# EasyEDA Pro project CH585M-R1(3)(1)(5).eprj, board PCB7
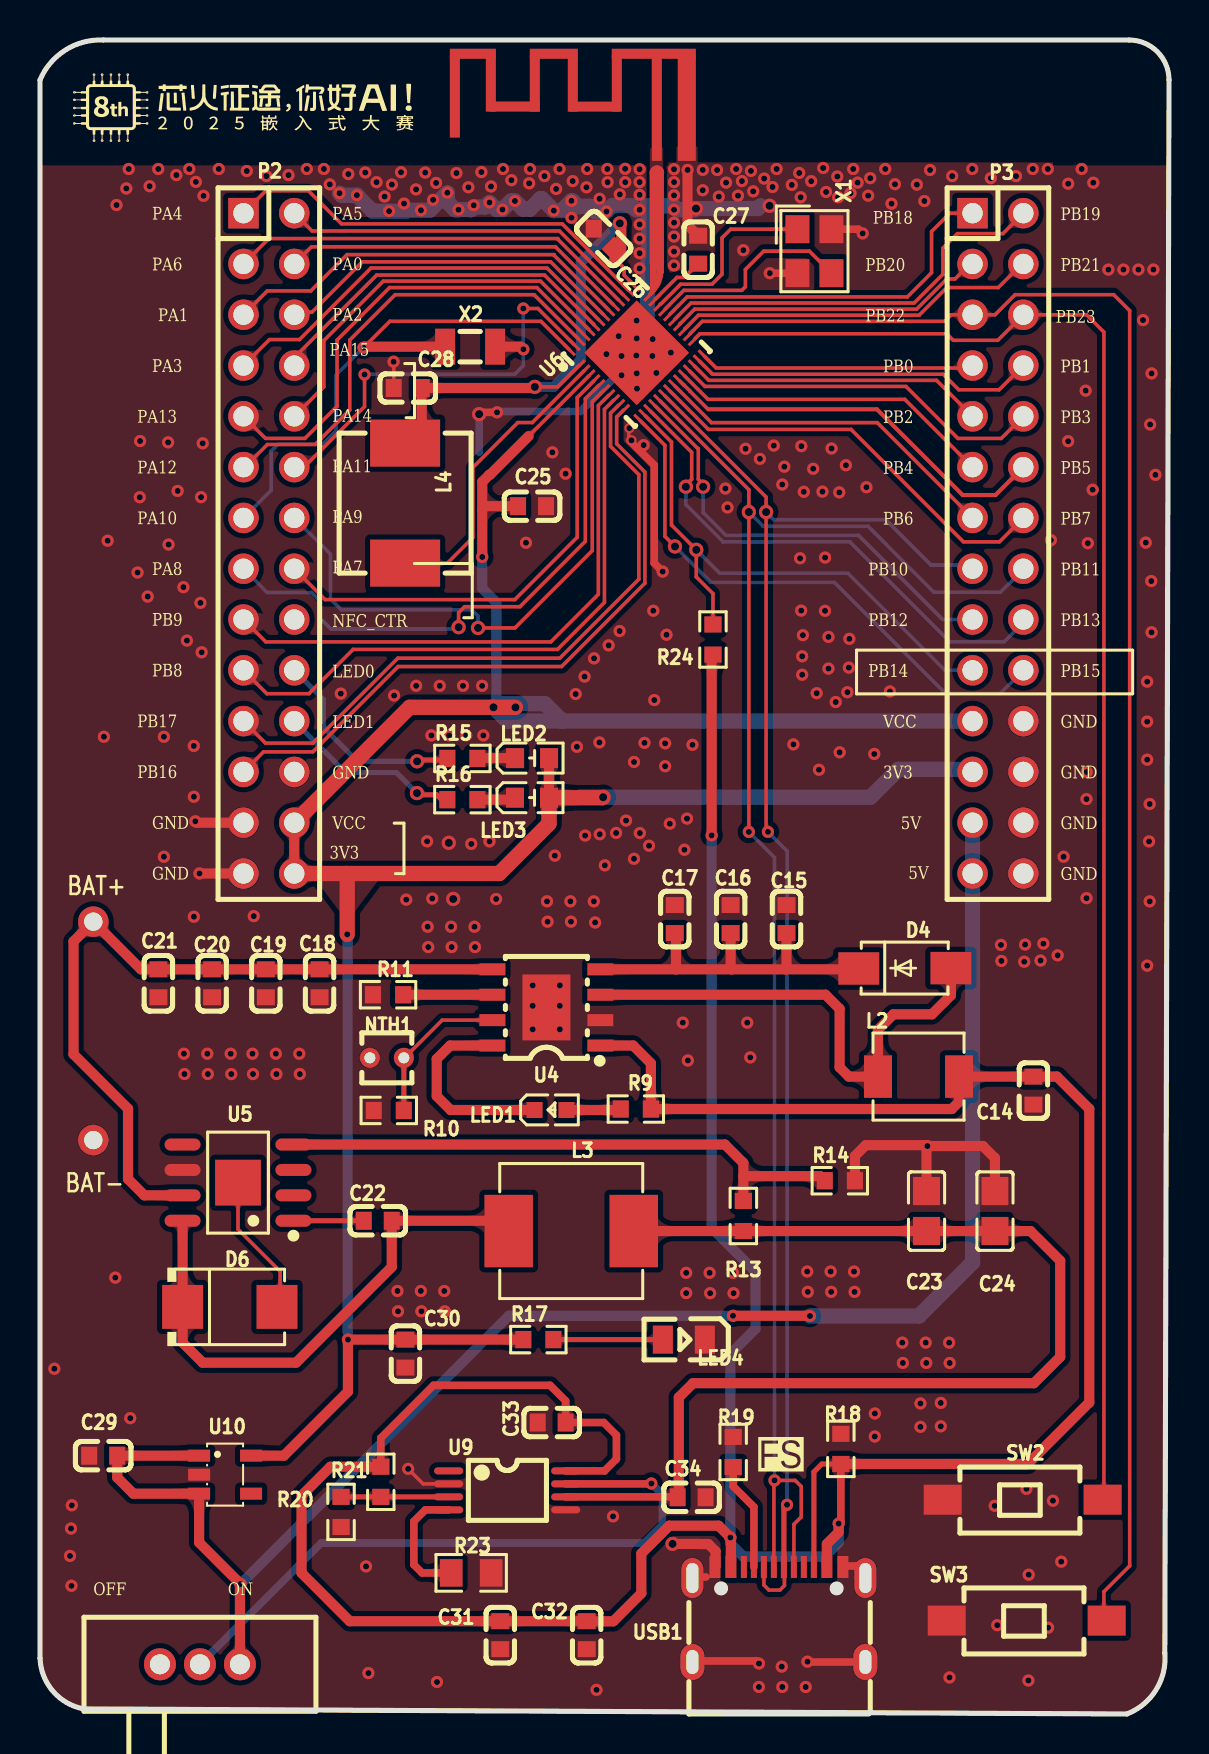
[diagram p10: board, top side]
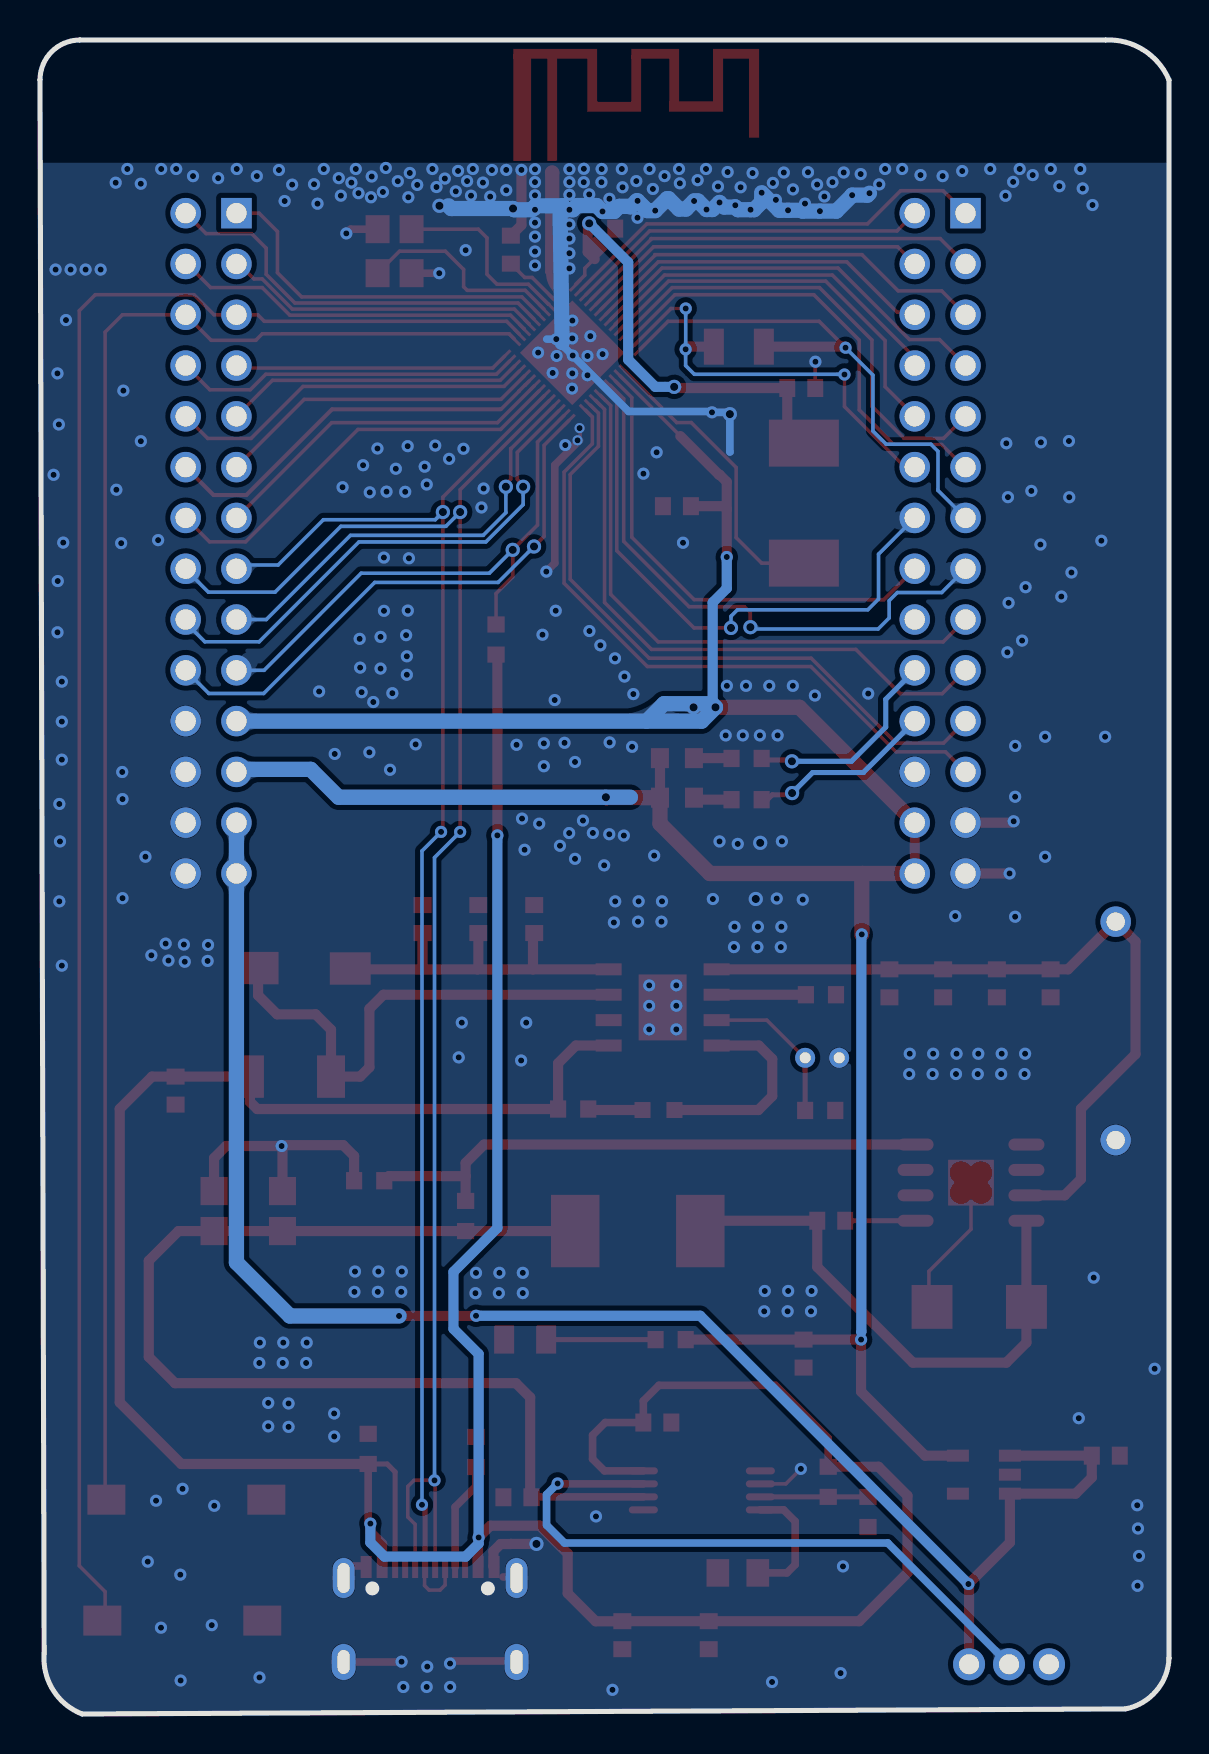
[diagram p11: board, bottom side, seen from below]

Outline 56.47 x 83.71 mm; copper layers: Top Layer, Bottom Layer. Coordinates in mm from the lower left corner of the outline.
Outline path: 0,81.71 arc(1.27,83.21) 3.16,83.71 54.47,83.71 arc(55.88,83.13) 56.47,81.71 56.26,3.05 arc(55.82,1.21) 54.36,0 2.18,0.25 arc(0.65,1.14) 0,2.79 0,81.71
Stack: Top Layer 0.035mm / Dielectric1 1.51mm FR4 er 4.5 / Bottom Layer 0.035mm

## Design rules (mm)
net PB11: DP1
net PB10: DP1
template: 自定义配置
spacing Clearance (default): track to track 0.127, other pairs 0 to 0.152
spacing Clearance_1: track to track 0.152, other pairs 0.152 to 0.152
spacing Clearance_3: track to track 0.254, other pairs 0 to 0.254
track width Width (default): min 0.127, default 0.178, max 1.27
differential pair DiffPairsRouting (default): width min 0.178, default 0.381, max 0.381; gap min 0.152, default 0.254
via RoutingVias (default): diameter min 0.508, default 0.61, max 1.27; hole min 0.305, default 0.305, max 0.711
region e2530 uses Clearance_1, DiffPairsRouting, HoleToHoleClearance, PlaneConnect, RF, RoutingVias, Width

## Placement (name value [footprint] x y rotation side)
C14  100nF  [C0603]  49.69 31.17 90 top
C15  10uF  [C0603]  37.34 39.75 270 top
C16  10uF  [C0603]  34.54 39.75 270 top
C17  10uF  [C0603]  31.75 39.75 270 top
C18  10uF  [C0603]  13.98 36.54 90 top
C19  10uF  [C0603]  11.3 36.54 90 top
C20  10uF  [C0603]  8.61 36.54 90 top
C21  10uF  [C0603]  5.92 36.54 90 top
C22  100nF  [C0603]  16.89 24.67 0 top
C23  22uF  [C0805]  44.34 25.15 90 top
C24  22uF  [C0805]  47.76 25.15 90 top
C25  2.2uF  [C0603]  24.61 60.4 180 top
C26  100nF  [C0603#2]  28.19 73.78 135 top
C27  470nF  [C0603]  32.92 73.23 270 top
C28  4.7uF  [C0603]  18.39 66.31 0 top
C29  10uF  [C0603]  3.16 12.92 0 top
C30  22uF  [C0603]  18.28 18.02 90 top
C31  22uF  [C0603]  23.02 3.94 90 top
C32  22uF  [C0603]  27.34 3.94 90 top
C33  100nF  [C0603]  25.59 14.58 180 top
C34  100nF  [C0603]  32.59 10.84 180 top
D4  SS54  [SMA_L4.3-W2.6-LS5.0-FD]  43.26 37.29 180 top
D6  SS54SMB  [SMB_L4.6-W3.6-LS5.3-RD]  9.49 20.36 0 top
E1  F  [ANT-F-1-2.4G-1.6mmFR4]  30.86 77.98 0 top
L2  2.2uH  [IND-SMD_L4.4-W4.2]  43.94 31.88 0 top
L3  15uH  [IND-SMD_L7.0-W6.6_FXL0630]  26.57 24.15 180 top
L4  10uH  [IND-SMD_L7.3-W6.8]  18.26 60.55 90 top
LED1  LTST-C190KSKT  [LED0603-RD]  25.53 30.2 0 top
LED2  YLED0603B  [LED0603-FD]  24.61 45.82 180 top
LED3  YLED0603R  [LED0603-FD]  24.61 47.8 180 top
LED4  NCD0805R1  [LED0805-R-RD]  32.2 18.72 180 top
NOREF  -  [Pad_e1653]  2.67 28.7 0 top
NOREF#2  -  [Pad_e1652]  2.67 39.62 0 top
NTH1  100K  [RES-TH_L2.5-W2.5-P1.70-D0.3]  17.35 32.81 180 top
P2  HEADER 14x2  [IDC28-2.54MM]  10.18 75.05 0 top
P3  HEADER 14x2  [IDC28-2.54MM]  46.64 75.05 0 top
R9  1kΩ  [R0603]  29.8 30.25 180 top
R10  82kΩ  [R0603]  17.45 30.18 180 top
R11  1kΩ  [R0603]  17.41 35.97 180 top
R13  10kΩ  [R0603]  35.18 24.9 90 top
R14  3.16kΩ  [R0603]  40.01 26.67 0 top
R15  1kΩ  [R0603]  21.13 47.78 0 top
R16  1kΩ  [R0603]  21.13 45.72 0 top
R17  1kΩ  [R0603]  24.93 18.72 0 top
R18  5.1kΩ  [R0603]  40.06 13.26 270 top
R19  5.1kΩ  [R0603]  34.67 13.1 270 top
R20  10kΩ  [R0603]  15.06 10.11 90 top
R21  47kΩ  [R0603]  17.05 11.61 90 top
R23  400Ω  [R0805]  21.57 7.06 180 top
R24  10kΩ  [R0603]  33.66 53.73 270 top
SW1  SSSS916900  [SW-TH_SSSS916900]  8 2.49 90 top
SW2  TS-1101-C-W  [SW-SMD_L6.0-W3.3-LS8.0]  49.15 10.72 0 top
SW3  TS-1101-C-W  [SW-SMD_L6.0-W3.3-LS8.0]  49.35 4.67 0 top
U4  SCS5090EA  [ESOP-8_L4.9-W3.9-P1.27-LS6.0-BL-EP3.3]  25.33 35.33 90 top
U5  TPS5450DDAR  [SOP-8_L4.9-W3.9-P1.27-LS6.0-BL-EP]  9.9 26.57 90 top
U6  CH585M  [QFN-48_L5.0-W5.0-P0.35-TL-EP3.7-1]  29.85 68.07 45 top
U9  TPS2113APWR  [TSSOP-8_L4.4-W3.0-P0.65-LS6.4-BL]  23.37 11.18 270 top
U10  XC6219B332MR-G  [SOT-23-5_L3.0-W1.7-P0.95-LS2.8-BR]  9.26 11.97 180 top
USB1  TYPE-C 16PIN 2MD(073)  [USB-C-SMD_TYPE-C-6PIN-2MD-073]  36.96 4.98 0 top
X1  32MHz  [CRYSTAL-SMD_4P-L3.2-W2.5-BL]  38.73 73.15 270 top
X2  32.768kHz  [FC-135R_L3.2-W1.5]  21.51 68.37 0 top

## Footprints (pads in the part's own frame, mm; a bottom-side part is the same pattern mirrored in y, then rotated)
ANT-F-1-2.4G-1.6mmFR4
  rect 0.8x0.6 smd: 0(1.483,0)
  rect 0.4x0.6 smd: 1(0,0)
C0603
  rect 0.8x0.9 smd: 1(-0.7,0) 2(0.7,0)
C0603#2
  rect 0.8x0.9 smd: 1(-0.7,0)
  rect 0.8x0.9 smd rot 45: 2(0.7,0)
C0805
  rect 1.41x1.35 smd: 1(-1,0) 2(1,0)
CRYSTAL-SMD_4P-L3.2-W2.5-BL
  rect 1.4x1.2 smd: 1(-1.1,-0.85) 2(1.1,-0.85) 3(1.1,0.85) 4(-1.1,0.85)
ESOP-8_L4.9-W3.9-P1.27-LS6.0-BL-EP3.3
  rect 0.6x1.3 smd: 1(-1.905,-2.7) 2(-0.635,-2.7) 3(0.635,-2.7) 4(1.905,-2.7) 5(1.905,2.7) 6(0.635,2.7) 7(-0.635,2.7) 8(-1.905,2.7)
  rect 3.3x2.4 smd: 9(0,0)
FC-135R_L3.2-W1.5
  rect 1x1.8 smd: 1(-1.25,0) 2(1.25,0)
IDC28-2.54MM
  rect 1.524x1.524 hole 1.016: 1(0,0)
  round 1.524 hole 1.016: 2(2.54,0) 3(0,-2.54) 4(2.54,-2.54) 5(0,-5.08) 6(2.54,-5.08) 7(0,-7.62) 8(2.54,-7.62) 9(0,-10.16) 10(2.54,-10.16) 11(0,-12.7) 12(2.54,-12.7) 13(0,-15.24) 14(2.54,-15.24) 15(0,-17.78) 16(2.54,-17.78) 17(0,-20.32) 18(2.54,-20.32) 19(0,-22.86) 20(2.54,-22.86) 21(0,-25.4) 22(2.54,-25.4) 23(0,-27.94) 24(2.54,-27.94) 25(0,-30.48) 26(2.54,-30.48) 27(0,-33.02) 28(2.54,-33.02)
IND-SMD_L4.4-W4.2
  rect 1.4x2.12 smd: 1(2.028,0) 2(-2.028,0)
IND-SMD_L7.0-W6.6_FXL0630
  rect 2.424x3.62 smd: 1(3.128,0) 2(-3.128,0)
IND-SMD_L7.3-W6.8
  rect 2.35x3.5 smd: 1(-3,0) 2(3,0)
LED0603-FD
  rect 0.9x1 smd: 1(-0.85,0) 2(0.85,0)
LED0603-RD
  rect 0.8x0.8 smd: 1(-0.799,0) 2(0.799,0)
LED0805-R-RD
  rect 1x1.399 smd: 1(1.05,0) 2(-1.05,0)
Pad_e1652
  round 1.524 hole 0.914: 1(0,0)
Pad_e1653
  round 1.524 hole 0.914: 1(0,0)
QFN-48_L5.0-W5.0-P0.35-TL-EP3.7-1
  rect 0.8x0.15 smd: 1(-2.5,1.575) 2(-2.5,1.225) 3(-2.5,0.875) 4(-2.5,0.525) 5(-2.5,0.175) 6(-2.5,-0.175) 7(-2.5,-0.525) 8(-2.5,-0.875) 9(-2.5,-1.225) 10(-2.5,-1.575) 25(2.5,-1.575) 26(2.5,-1.225) 27(2.5,-0.875) 28(2.5,-0.525) 29(2.5,-0.175) 30(2.5,0.175) 31(2.5,0.525) 32(2.5,0.875) 33(2.5,1.225) 34(2.5,1.575)
  rect 0.15x0.8 smd: 11(-2.275,-2.5) 12(-1.925,-2.5) 13(-1.575,-2.5) 14(-1.225,-2.5) 15(-0.875,-2.5) 16(-0.525,-2.5) 17(-0.175,-2.5) 18(0.175,-2.5) 19(0.525,-2.5) 20(0.875,-2.5) 21(1.225,-2.5) 22(1.575,-2.5) 23(1.925,-2.5) 24(2.275,-2.5) 35(2.275,2.5) 36(1.925,2.5) 37(1.575,2.5) 38(1.225,2.5) 39(0.875,2.5) 40(0.525,2.5) 41(0.175,2.5) 42(-0.175,2.5) 43(-0.525,2.5) 44(-0.875,2.5) 45(-1.225,2.5) 46(-1.575,2.5) 47(-1.925,2.5) 48(-2.275,2.5)
  rect 3.7x3.7 smd: 49(0.001,0)
R0603
  rect 0.806x0.864 smd: 1(-0.753,0) 2(0.753,0)
R0805
  rect 1.133x1.377 smd: 1(-1,0) 2(1,0)
RES-TH_L2.5-W2.5-P1.70-D0.3
  round 1 hole 0.55: 1(-0.85,0) 2(0.85,0)
SMA_L4.3-W2.6-LS5.0-FD
  rect 2.046x1.62 smd: 1(-2.304,-0.009) 2(2.304,0.009)
SMB_L4.6-W3.6-LS5.3-RD
  rect 2.047x2.192 smd: 1(-2.361,0) 2(2.361,0)
SOP-8_L4.9-W3.9-P1.27-LS6.0-BL-EP
  oval 0.6x1.8 smd: 1(-1.905,-2.772) 2(-0.635,-2.772) 3(0.635,-2.772) 4(1.905,-2.772) 5(1.905,2.772) 6(0.635,2.772) 7(-0.635,2.772) 8(-1.905,2.772)
  rect 2.29x2.29 smd: 9(0,0)
SOT-23-5_L3.0-W1.7-P0.95-LS2.8-BR
  rect 1.1x0.6 smd: 1(1.3,-0.95) 2(1.3,0) 3(1.3,0.95) 4(-1.3,0.95) 5(-1.3,-0.95)
SW-SMD_L6.0-W3.3-LS8.0
  rect 1.9x1.5 smd: 1(-4,0) 2(4,0)
SW-TH_SSSS916900
  round 1.6 hole 1: 1(0,2) 2(0,0) 3(0,-2)
TSSOP-8_L4.4-W3.0-P0.65-LS6.4-BL
  oval 0.353x1.454 smd: 1(-0.975,-2.927) 2(-0.325,-2.927) 3(0.325,-2.927) 4(0.975,-2.927) 5(0.975,2.927) 6(0.325,2.927) 7(-0.325,2.927) 8(-0.975,2.927)
USB-C-SMD_TYPE-C-6PIN-2MD-073
  rect 0.55x1.1 smd: 1(-3.2,2.375) 2(-2.4,2.375) 11(2.4,2.375) 12(3.2,2.375)
  rect 0.3x1.1 smd: 3(-1.75,2.375) 4(-1.25,2.375) 5(-0.75,2.375) 6(-0.25,2.375) 7(0.25,2.375) 8(0.75,2.375) 9(1.25,2.375) 10(1.75,2.375)
  oval 1.1x2 hole 0.6x1.5: 13(-4.325,1.825) 14(4.325,1.825)
  oval 1.2x1.8 hole 0.6x1.2: 13(-4.325,-2.375) 14(4.325,-2.375)

## Nets
As in the schematic, except:
GND: C14.1 C15.1 C16.1 C17.1 C18.1 C19.1 C20.1 C21.1 C23.2 C24.2 C25.1 C26.2 C27.1 C28.1 C29.1 C30.1 C31.1 C32.1 C33.2 C34.1 LED4.2 NOREF.1 NTH1.2 P2.24 P2.25 P2.27 P3.22 P3.24 P3.26 P3.28 R10.2 R11.2 R14.2 R18.1 R19.1 R20.1 R23.1 SW2.1 SW3.1 U4.2 U4.9 U5.6 U6.49 U9.2 U9.5 U10.2 USB1.1 USB1.12 USB1.13 USB1.14 X1.2 X1.4
BAT+: C18.2 C19.2 C20.2 C21.2 NOREF#2.1 U4.5 U5.7

Pads without a net: E1 0; P2 18; SW1 1; U5 2 3 5; U9 1; U10 4; USB1 3 9

## Via types
v1: diameter 0.61, hole 0.305, Top Layer to Bottom Layer, 387 vias
v2: diameter 0.711, hole 0.406, Top Layer to Bottom Layer, 21 vias
v3: diameter 0.508, hole 0.305, Top Layer to Bottom Layer, 2 vias

## Routing (per net, layer and track width the routed paths; a pad name or vN(x,y) marks a point on that pad's centre or on a via; arc(x,y) is an arc through that point)
+3V3: length 145.5
  Top Layer w0.178: 27.46,66.92 24.44,63.9
  Top Layer w0.508: 22.12,60.24 22.28,60.4 C25.2 ; 22.12,60.24 v1(22.12,57.86) ; 22.12,60.24 22.12,61.61 22.48,61.97 22.51,61.97 24.44,63.9 ; LED3.1 25.46,47.8 LED2.1 ; U10.5 12.2,12.92 15.4,16.12 v1(15.4,18.72) C30.2 R17.1 ; P2.26 P2.28
  Top Layer w0.762: 15.33,42.03 15.37,41.99 v1(15.37,38.99) ; 15.33,42.03 P2.28 ; 15.33,42.03 22.97,42.03 25.46,44.52 LED2.1 28.14,45.82 v2(28.17,45.84) ; P2.26 18.49,50.34 v2(22.68,50.34) 22.69,50.34 v2(23.78,50.34)
  Bottom Layer w0.508: 22.86,50.52 22.83,50.56 22.83,55.58 22.12,56.29 v1(22.12,57.86) ; 15.4,19.11 15.39,19.12 15.39,38.94 15.37,38.96 v1(15.37,38.99)
  Bottom Layer w0.762: 26.94,45.84 v2(28.17,45.84) 41.54,45.84 42.93,47.24 46.52,47.24 P3.23 ; 26.13,49.65 23.37,49.65 v2(22.68,50.34) 22.86,50.52 25.26,50.52 26.13,49.65 ; 26.13,49.65 P3.21
+5V: length 177.8
  Top Layer w0.254: 38.71,7.35 38.71,12.1 39.11,12.5 R18.2
  Top Layer w0.381: R18.2 40.06,9.63 v1(39.95,9.52) ; R21.2 17.05,13.8 19.68,16.44 25.51,16.44 26.29,15.66 C33.1 28.2,14.58 28.83,13.94 28.83,12.75 28.24,12.16 U9.8
  Top Layer w0.508: v1(39.95,9.52) 39.95,9.09 39.36,8.51 USB1.11 ; USB1.2 34.56,8.8 v1(34.53,8.83) 33.94,9.42 31.47,9.42 30.08,8.02 30.08,6.04 28.68,4.64 27.35,4.64 C32.2 C31.2 15.49,4.64 13.08,7.05 13.08,10.92 14.53,12.37 R21.2 ; R24.2 33.59,52.91 v1(33.59,43.94) ; 28.03,33.43 29.67,33.43 30.55,32.54 30.55,30.25 45.6,30.25 45.97,30.62 L2.1 C14.2 50.87,31.88 52.48,30.26 52.48,15.58 49.4,12.5 R18.2
  Bottom Layer w0.508: v1(39.95,9.52) 39.95,8.57 39.24,7.87 35.18,7.87 34.53,8.52 v1(34.53,8.83) 34.53,18 35.79,19.26 35.79,22.11 33.59,24.31 v1(33.59,43.94)
GND: length 91.6
  Top Layer w0.178: 29.45,63.72 29.45,64.29 29.46,64.3 ; C28.1 17.69,67.61 v1(17.69,67.62) ; v1(18.41,12.26) 19.16,11.51 U9.2
  Top Layer w0.381: 41.38,6.85 40.83,7.4 40.26,7.4 ; 20.65,40.78 v2(20.67,40.76) ; X1.2 v1(36.5,72.05) ; USB1.14 38.4,2.6 v1(38.39,2.62) ; X1.4 40.94,74.25 v1(41.15,74.04) ; v1(31.14,57.13) 30.72,57.55 30.72,62.45 29.48,63.69 ; 32.73,2.65 35.83,2.65 v1(35.96,2.52) ; v2(21.96,65) 22.06,65.09 v1(22.86,65.09) ; 32.73,6.85 33.31,6.85
  Top Layer w0.508: USB1.1 33.79,7.38 33.79,8.14 33.43,8.5 32.92,8.5 32.92,8.51 v2(31.64,8.51) ; P2.25 7.84,44.57 v1(7.77,44.64) ; v1(44.38,28.4) 44.34,28.45 41.3,28.45 40.76,27.9 R14.2 ; v1(44.38,28.4) 44.34,28.36 44.34,25.94 ; v1(44.38,28.4) 47.16,28.4 47.76,27.8 47.76,26 ; v1(32.39,77.21) 32.39,74.45 C27.1 ; P2.27 7.98,42.03
  Bottom Layer w0.381: 21.95,63.11 21.96,63.12 v2(21.96,65) 22.06,65.09 v1(22.86,65.09) 22.9,65.14 27.03,65.14 v1(29.83,67.93) v1(30.65,68.75) 31.12,68.75
  Bottom Layer w0.762: 30.33,75.42 31.68,75.42 31.88,75.22 32.75,75.22 v2(32.81,75.28) 35.9,75.28 36.04,75.42 ; 30.33,75.42 30.14,75.22 29.81,75.22 29.6,75.43 28.63,75.43 v1(28.33,75.14) 27.75,75.14 27.5,75.39 26.96,75.39 ; 30.33,75.42 30.46,75.29 30.35,68.58 ; 20.37,75.85 20.37,75.6 20.75,75.23 v1(20.93,75.23) 21.56,75.23 21.69,75.36 22.26,75.36 v1(22.48,75.59) 22.84,75.23 v1(23.13,75.23) 23.56,75.66 v1(23.76,75.66) 24.16,75.25 24.51,75.25 25.03,75.77 25.11,75.77 v1(25.7,75.18) 26.09,75.18 v1(26.58,75.67) 26.63,75.67 26.94,75.36 ; v1(20.37,76.07) 19.5,75.2 v1(19.05,75.2) 18.37,75.2 18.33,75.15 v1(17.46,75.15) 16.64,75.15 15.85,75.94 v1(15.85,75.95) 15.08,75.95 v1(14.98,76.05)
  vias: v1(0.72,17.26) v1(1.55,9.28) v1(1.5,7.91) v1(1.59,10.44) v1(1.58,6.41) v1(3.2,48.87) v1(3.38,58.67) v1(3.77,21.82) v1(3.83,75.46) v1(4.32,76.29) v1(4.44,77.26) v1(4.51,14.79) v1(4.88,57.08) v1(5.01,63.66) v1(4.99,60.85) v1(5.39,55.88) v1(5.48,76.4) v1(5.92,77.26) v1(6.2,48.87) v1(6.2,42.87) v1(6.41,63.59) v1(6.43,58.48) v1(6.82,76.96) v1(6.89,61.16) v1(7.17,56.35) v1(7.2,33.02) v1(7.23,32) v1(7.35,53.68) v1(7.47,77.26) v1(7.69,48.41) v1(7.7,45.87) v1(7.7,39.87) v1(7.8,76.61) v1(8.06,60.85) v1(8.03,55.56) v1(7.97,42.03) v1(8.14,63.54) v1(8.09,53.09) v1(8.18,75.92) v1(8.37,33.02) v1(8.4,32) v1(8.94,77.26) v1(9.54,33.02) v1(9.57,32) v1(10.34,77.16) v1(10.63,33.02) v1(10.65,32) v1(10.69,39.9) v1(11.32,76.9) v1(11.8,33.02) v1(11.83,32) v1(12.43,76.96) v1(12.97,33.02) v1(13,32) v1(13.35,77.26) v1(14.2,77.26) v1(14.49,76.49) v1(15.05,51.03) v1(15.42,77.01) v1(16.27,77.08) v1(16.31,7.38) v1(16.43,2.04) v1(16.83,76.6) v1(17.24,75.88) v1(17.6,76.48) v1(17.71,50.93) v1(17.88,21.15) v1(17.91,20.14) v1(18.06,77.1) v1(18.21,75.53) v1(18.32,40.72) v1(18.81,76.24) v1(18.82,51.41) v1(19.05,21.15) v1(19.08,20.14) v1(19.27,77.08) v1(19.36,43.64) v1(19.39,39.37) v1(19.42,38.35) v1(19.66,75.72) v1(19.58,48.94) v1(19.62,40.78) v1(19.81,76.56) v1(19.86,1.6) v1(19.99,51.41) v1(20.22,21.15) v1(20.25,20.14) v1(20.46,48.94) v1(20.56,39.37) v1(20.59,38.35) v1(20.83,77.06) v1(21.16,51.41) v1(21.32,48.94) v1(21.43,76.35) v1(21.57,43.51) v1(21.69,75.45) v1(21.73,39.37) v1(21.76,38.35) v1(22.08,77.11) v1(22.11,51.41) v1(22.17,48.94) v1(22.56,76.39) v1(22.48,43.64) v1(22.81,40.75) v1(23.16,77.26) v1(23.58,76.7) v1(24.31,58.57) v1(24.47,76.54) v1(24.51,77.26) v1(24.64,36.44) v1(24.64,35.42) v1(24.64,34.24) v1(25.23,76.9) v1(25.36,40.64) v1(25.39,39.62) v1(25.63,63.09) v1(25.75,42.92) v1(25.81,76.26) v1(25.98,77.26) v1(26,36.44) v1(26,35.42) v1(26,34.24) v1(26.29,62.02) v1(26.53,40.64) v1(26.56,39.62) v1(26.64,76.65) v1(26.59,74.82) v1(26.79,51) v1(26.86,48.36) v1(27.24,51.88) v1(27.27,43.93) v1(27.37,77.26) v1(27.33,76.35) v1(27.71,52.79) v1(27.7,40.64) v1(27.77,39.58) v1(27.84,1.21) v1(27.99,75.77) v1(27.98,48.58) v1(28,43.99) v1(28.25,42.44) v1(28.33,68) v1(28.38,77.26) v1(28.39,76.6) v1(28.44,53.44) v1(28.66,9.88) v1(28.82,44.06) v1(28.94,68.9) v1(29,75.99) v1(28.99,54.16) v1(29.09,67.91) v1(29.09,66.94) v1(29.27,77.27) v1(29.27,76.6) v1(29.31,44.68) v1(29.71,47.61) v1(29.71,42.76) v1(29.84,69.68) v1(29.85,68.79) v1(29.85,67.04) v1(29.86,66.28) v1(29.99,77.25) v1(29.99,76.6) v1(29.99,75.97) v1(29.99,75.22) v1(29.99,74.49) v1(29.99,73.78) v1(29.99,73.05) v1(29.99,72.29) v1(30,44.05) v1(30.2,63.45) v1(30.23,48.56) v1(30.46,43.42) v1(30.63,67.91) v1(30.68,55.17) v1(30.73,50.7) v1(30.83,67.06) v1(31.27,48.54) v1(31.27,47.39) v1(31.34,53.97) v1(31.55,68.08) v1(31.5,44.52) v1(31.71,77.25) v1(31.71,76.6) v1(31.71,75.94) v1(31.71,75.22) v1(31.71,74.58) v1(31.71,73.88) v1(31.71,73.13) v1(31.71,72.44) v1(32.15,34.57) v1(32.23,43.22) v1(32.36,44.78) v1(32.32,22.06) v1(32.32,21.05) v1(32.41,32.68) v1(32.64,48.47) v1(33.15,77.21) v1(33.15,76.2) v1(33.49,22.06) v1(33.52,21.04) v1(33.87,77.21) v1(33.95,75.88) v1(34.32,76.58) v1(34.28,61.28) v1(34.39,60.33) v1(34.66,22.06) v1(34.69,21.04) v1(34.82,77.26) v1(34.91,75.93) v1(35.11,76.65) v1(35.18,73.2) v1(35.29,63.27) v1(35.37,34.57) v1(35.56,77.16) v1(35.53,32.83) v1(35.67,76.14) v1(35.96,1.35) v1(36.01,62.76) v1(36.22,76.78) v1(36.64,76.36) v1(36.7,63.43) v1(36.84,77.26) v1(37.13,61.48) v1(37.1,2.37) v1(37.13,1.35) v1(37.23,62.37) v1(37.6,76.46) v1(37.68,48.49) v1(37.97,77.06) v1(38.05,75.85) v1(38.02,57.79) v1(38.08,63.4) v1(38.07,55.18) v1(38.16,53.95) v1(38.12,52.89) v1(38.12,51.97) v1(38.2,61.12) v1(38.3,1.35) v1(38.37,22.13) v1(38.4,21.11) v1(38.57,76.65) v1(38.67,62.27) v1(38.85,51.05) v1(38.96,47.22) v1(39.14,61.13) v1(39.17,77.31) v1(39.27,57.83) v1(39.26,55.17) v1(39.32,76.11) v1(39.44,53.86) v1(39.44,52.28) v1(39.54,22.13) v1(39.57,21.11) v1(39.59,63.28) v1(39.8,50.6) v1(39.88,76.88) v1(39.92,75.85) v1(39.98,61.09) v1(40,48.09) v1(40.31,62.45) v1(40.46,52.33) v1(40.38,51.1) v1(40.54,76.05) v1(40.48,53.76) v1(40.67,77.26) v1(40.71,22.13) v1(40.74,21.11) v1(40.89,76.58) v1(41.34,61.35) v1(41.42,75.93) v1(41.53,76.8) v1(41.73,48.01) v1(41.76,15.03) v1(41.75,13.88) v1(42.28,77.26) v1(42.51,51.13) v1(42.59,75.53) v1(42.76,76.5) v1(43.13,18.57) v1(43.16,17.55) v1(43.86,76.48) v1(44.04,15.53) v1(44.04,14.36) v1(44.23,75.66) v1(44.3,18.57) v1(44.33,17.55) v1(44.52,77.21) v1(45.05,15.56) v1(45.05,14.39) v1(45.47,18.57) v1(45.5,17.55) v1(45.49,1.83) v1(45.62,76.9) v1(46.63,77.26) v1(47.56,76.8) v1(47.75,10.41) v1(47.88,4.44) v1(48.06,38.46) v1(48.09,37.66) v1(48.82,76.9) v1(49.23,37.62) v1(49.27,38.48) v1(49.34,11.26) v1(49.45,6.97) v1(49.44,1.67) v1(49.66,77.26) v1(50.05,37.68) v1(50.18,38.53) v1(50.41,77.26) v1(50.42,4.32) v1(50.56,58.7) v1(50.67,10.67) v1(50.9,37.94) v1(51.08,7.62) v1(51.2,42.87) v1(51.43,76.52) v1(51.42,63.65) v1(52.1,77.26) v1(52.3,66.18) v1(52.36,47.11) v1(52.34,45.75) v1(52.34,40.8) v1(52.41,58.55) v1(52.65,61.22) v1(52.68,76.57) v1(53.44,72.23) v1(54.19,72.23) v1(54.94,72.23) v1(55.17,69.7) v1(55.31,58.58) v1(55.38,51.62) v1(55.38,49.63) v1(55.38,47.72) v1(55.47,43.63) v1(55.38,37.42) v1(55.53,64.48) v1(55.5,45.51) v1(55.5,40.64) v1(55.6,67.04) v1(55.58,56.65) v1(55.6,54.09) v1(55.69,72.23) v1(55.79,61.97) v2(20.45,43.56) v2(36.49,75.42) v3(29.48,64.3) v3(29.58,63.69)
V5V: length 84.3
  Top Layer w0.508: 10,2.49 10,6.47 v1(10.03,6.5) 7.96,8.57 U10.3 4.67,11.02 3.86,11.82 C29.2 U10.1 ; v1(34.66,19.91) 38.5,19.91 v1(38.51,19.9)
  Bottom Layer w0.508: v1(10.03,6.5) 23.45,19.91 v1(34.66,19.91)
  Bottom Layer w0.762: v1(38.51,19.9) 43.97,19.9 46.64,22.58 P3.27 P3.25
VINTA: length 2.5
  Top Layer w0.178: 30.77,70.75 31.86,71.84 32.23,71.84 32.62,72.23 32.64,72.23
ANT: length 13.6
  Top Layer w0.178: 31.12,73.37 31.12,72.1 31.07,72.05 arc(30.98,71.58) 30.71,71.19 30.52,70.99 ; 30.52,70.99 arc(30.65,71.19) 30.7,71.43 30.76,71.48 30.76,72.53 ; 30.52,70.99 arc(30.53,71) 30.54,71.01 ; 30.52,70.99 arc(30.53,71) 30.54,71.01 ; 30.52,70.99 arc(30.53,71.01) 30.54,71.03 30.6,71.1 30.6,72.57 ; 30.52,70.99 arc(30.53,71) 30.54,71.01 ; 30.52,70.99 arc(30.73,71.31) 30.8,71.68 30.91,71.79 ; 30.52,70.99 arc(30.78,71.36) 30.91,71.79 ; 30.93,71.98 30.92,71.96 arc(30.92,71.87) 30.91,71.79 ; 30.93,71.98 30.93,72.39 ; 30.93,71.98 30.98,72.03 30.98,72.34 30.93,72.39 ; 30.93,71.98 30.93,71.81 30.91,71.79 ; 30.93,72.39 30.8,72.52
  Top Layer w0.714: 30.85,72.57 30.85,77.08 30.86,77.09
BAT+: length 38.5
  Top Layer w0.508: U5.7 5.22,25.94 4.4,26.75 4.4,30.27 1.68,32.99 1.68,38.63 NOREF#2.1 5.05,37.24 C21.2 C20.2 C19.2 C18.2 22.69,37.24
BATO: length 57.3
  Top Layer w0.381: C34.2 31.87,10.86 26.29,10.86
  Top Layer w0.508: L3.2 R13.1 C23.1 C24.1 49.54,24.15 51.03,22.66 51.03,17.86 49.72,16.54 32.66,16.54 31.95,15.83 31.95,10.9 C34.2
BOOT: length 89.2
  Top Layer w0.178: 53.21,4.7 53.21,6.12 54.5,7.41 54.5,70.18 53.7,70.97 48.77,70.97 47.77,69.97 P3.5 45.58,69.97 45.25,69.64 33.13,69.64 32.5,69.01
EP: length 27.3
  Top Layer w0.508: 23.44,24.15 22.93,24.67 C22.2 17.59,22.35 12.81,17.57 8.14,17.57 7.13,18.57 D6.1 U5.8
FB: length 28.8
  Top Layer w0.508: R14.1 39.02,26.89 35.18,26.89 ; 35.18,26.89 35.18,27.55 34.26,28.48 U5.4 ; 35.18,26.89 35.18,25.81
LED0: length 10.6
  Top Layer w0.254: v2(18.86,47.64) 18.93,47.71 20.54,47.71 20.55,47.72
  Bottom Layer w0.254: v2(18.86,47.64) 15.88,47.64 14.17,49.35 14.17,50.74 P2.20
LED1: length 9.7
  Top Layer w0.254: R16.1 20.37,45.44 19.84,45.97 18.94,45.97 v2(18.85,46.05)
  Bottom Layer w0.254: P2.22 15.29,47.08 17.83,47.08 v2(18.85,46.05)
LX: length 25.3
  Top Layer w0.508: 28.09,35.97 39.29,35.97 39.99,35.26 39.99,32.34 40.46,31.88 L2.2 41.91,34.22 42.68,34.99 44.61,34.99 45.56,35.94 D4.1
PA0: length 17.5
  Top Layer w0.178: P2.4 13.58,73.37 25.78,73.37 28.69,70.47
PA1: length 20.7
  Top Layer w0.178: P2.5 11.37,71.16 13.54,71.16 15.36,72.98 25.72,72.98 25.72,72.94 28.44,70.22
PA2: length 17.7
  Top Layer w0.178: 28.19,69.97 25.54,72.62 16.12,72.62 13.6,70.1 12.85,70.1 P2.6
PA3: length 20.9
  Top Layer w0.178: P2.7 11.48,68.73 12.98,68.73 16.56,72.31 25.36,72.31 27.94,69.72
PA4: length 21.8
  Top Layer w0.178: P2.1 11.3,76.17 13.42,76.17 15.08,74.52 26.12,74.52 29.43,71.21
PA5: length 18.2
  Top Layer w0.178: 29.18,70.96 25.98,74.16 13.61,74.16 P2.2
PA6: length 20.6
  Top Layer w0.178: 28.93,70.71 25.9,73.74 25.9,73.78 11.45,73.78 P2.3
PA7: length 24.2
  Top Layer w0.178: P2.16 14.26,55.73 23.75,55.73 26.87,58.85 26.87,65.83 27.7,66.66
PA8: length 29.2
  Top Layer w0.178: v2(20.94,54.35) 20.94,55.07 21.24,55.37 24,55.37 27.28,58.64 27.28,65.77 27.95,66.44
  Bottom Layer w0.178: v2(20.94,54.35) 20.85,54.26 14.55,54.26 14,54.81 14,55.67 13.59,56.08 11.37,56.08 P2.15
PA9: length 28.7
  Top Layer w0.178: v2(21.91,54.31) 23.76,54.31 27.62,58.18 27.62,65.62 28.2,66.19
  Bottom Layer w0.178: v2(21.91,54.31) 21.91,54.89 21.58,55.22 15.07,55.22 14.53,55.75 14.53,58 P2.14
PA10: length 27.8
  Top Layer w0.178: 16.23,68.37 17.5,69.64 25.05,69.64 U6.48
  Top Layer w0.508: X2.1 16.23,68.37 v1(16.18,68.32)
  Bottom Layer w0.178: v1(16.18,68.32) 14.81,66.95 14.81,64.16 14.15,63.5 11.91,63.5 11.56,63.14 11.56,61.19 P2.13
PA11: length 22.1
  Top Layer w0.178: P2.12 13.2,62.35 16.23,65.38 v1(16.23,66.98) ; v1(24.17,70.28) 24.91,70.28 U6.47
  Top Layer w0.508: v1(24.18,68.24) 24.05,68.37 X2.2
  Bottom Layer w0.178: v1(16.23,66.98) 16.25,66.99 23.74,66.99 24.18,67.43 v1(24.18,68.24) 24.17,68.25 v1(24.17,70.28)
PA12: length 23.3
  Top Layer w0.178: 26.95,68.73 24.71,70.97 17.76,70.97 15.49,68.7 15.49,65.21 13.76,63.48 11.37,63.48 10.24,62.35
PA13: length 23.5
  Top Layer w0.178: P2.9 11.28,63.79 13.25,63.79 14.86,65.4 14.86,68.7 17.48,71.33 24.85,71.33 27.2,68.98
PA14: length 19.9
  Top Layer w0.178: 27.45,69.23 27.45,69.24 25.03,71.65 17.17,71.65 14.2,68.68 14.2,66.37 P2.10
PA15: length 18.1
  Top Layer w0.178: 27.7,69.48 27.7,69.49 25.23,71.96 16.84,71.96 12.72,67.83 P2.8
PB0: length 13.7
  Top Layer w0.178: P3.7 46.52,67.31 33.82,67.31 33.23,67.9
PB1: length 17.3
  Top Layer w0.178: 32.98,67.65 33.64,67 45.18,67 45.95,66.22 47.97,66.22 P3.8
PB2: length 14.9
  Top Layer w0.178: P3.9 44.84,66.69 33.45,66.69 32.74,67.41
PB3: length 18.5
  Top Layer w0.178: P3.10 48.08,63.79 45.91,63.79 43.31,66.39 33.26,66.39 32.49,67.16
PB4: length 16.3
  Top Layer w0.178: 32.24,66.91 33.41,65.74 43.25,65.74 P3.11
PB5: length 20.1
  Top Layer w0.178: 33.45,65.24 33.41,65.24 32.51,66.14 32.51,66.15 32.2,66.47 32.19,66.47 31.99,66.66
  Top Layer w0.203: 33.45,65.24 41.86,65.24 46.15,60.96 47.79,60.96 P3.12
PB6: length 17.6
  Top Layer w0.178: 31.75,66.42 33.59,64.57 41.88,64.57 P3.13
PB7: length 21.3
  Top Layer w0.178: P3.14 47.99,58.62 46.19,58.62 40.56,64.24 33.43,64.24 31.5,66.17
PB8: length 30.7
  Top Layer w0.178: P2.19 11.35,51.02 13.45,51.02 15.66,53.24 25.88,53.24 28.23,55.59 28.23,65.24 28.69,65.7
PB9: length 29.4
  Top Layer w0.178: 28.44,65.95 27.93,65.43 27.93,55.99 25.55,53.61 11.3,53.61 P2.17
PB10: length 75.7
  Top Layer w0.178: USB1.5 36.21,6.45 36.46,6.2 37.01,6.2 37.23,6.42 37.23,7.32 USB1.7 ; v1(36.41,44.11) 36.32,44.2 v2(36.32,60.11) 36.32,60.85 31.25,65.92
  Top Layer w0.254: v1(37.36,10.46) 37.21,10.31 USB1.7
  Bottom Layer w0.178: v1(36.41,44.11) 37.36,43.16 v1(37.36,10.46) ; P3.15 46.46,57.46 44.56,57.46 42.3,59.72 36.7,59.72 v2(36.32,60.11)
PB11: length 82.2
  Top Layer w0.178: 31,65.67 35.45,61.22 v2(35.45,60.11) v1(35.45,44.11) ; USB1.6 36.71,11.65 v1(36.74,11.68) 37.77,11.68 38.07,11.38 38.07,9.85 37.71,9.49 USB1.8
  Bottom Layer w0.178: v1(35.45,44.11) 36.74,42.83 v1(36.74,11.68) ; P3.16 49.18,57.24 48.04,56.1 44.71,56.1 41.42,59.39 36.17,59.39 v2(35.45,60.11)
PB12: length 22.1
  Top Layer w0.178: v2(33.17,61.37) 33.17,61.5 32.93,61.74 32.93,63.28 32.9,63.28 30.76,65.43
  Bottom Layer w0.178: P3.17 45.15,54.73 40.94,58.94 34.3,58.94 33.17,60.08 v2(33.17,61.37)
PB13: length 26
  Top Layer w0.178: 30.51,65.18 32.6,63.09 32.6,61.75 32.44,61.59 32.44,61.5 v2(32.3,61.37)
  Bottom Layer w0.178: P3.18 49.18,54.58 48.22,53.62 45.51,53.62 40.52,58.61 34.17,58.61 32.3,60.47 v2(32.3,61.37)
PB14: length 28.2
  Top Layer w0.178: R24.1 33.66,56.03 32.83,56.86 v2(32.83,58.21) 31.59,59.45 31.59,63.61 30.26,64.93
  Bottom Layer w0.178: P3.19 45.26,52.19 40.41,57.05 33.99,57.05 v2(32.83,58.21)
PB15: length 28
  Top Layer w0.178: 30.01,64.68 31.26,63.44 31.26,58.89 v2(31.76,58.38)
  Bottom Layer w0.178: v2(31.76,58.38) 33.56,56.58 39.73,56.58 45.28,51.03 48.03,51.03 P3.20
PB16: length 33.4
  Top Layer w0.178: P2.23 11.18,48.11 13.65,48.11 17.91,52.38 26.09,52.38 30.26,56.54 30.26,62.1 28.84,63.52 28.84,64.86 29.18,65.2
PB17: length 33.1
  Top Layer w0.178: P2.21 11.28,48.55 13.65,48.55 17.9,52.8 26,52.8 29.95,56.75 29.95,61.98 28.54,63.39 28.54,65.05 28.94,65.45
PB18: length 18.4
  Top Layer w0.178: P3.1 45.51,75.05 44.59,74.13 44.59,72.07 43.38,70.86 32.37,70.86 31.51,70
PB19: length 20.4
  Top Layer w0.178: 31.76,69.76 32.56,70.56 43.72,70.56 45.16,71.99 45.16,73.3 45.88,74.03 48.16,74.03 P3.2
PB20: length 15.9
  Top Layer w0.178: 32,69.51 32,69.51 32.75,70.25 43.85,70.25 45.36,71.76 45.77,71.76 46.52,72.51 P3.3
PB21: length 18.3
  Top Layer w0.178: 32.25,69.26 32.25,69.27 32.94,69.95 43.97,69.95 45.36,71.33 47.93,71.33 49.11,72.51 P3.4
PB23: length 80
  Top Layer w0.178: 53.21,10.67 53.21,69.1 52.35,69.97 P3.6 47.91,68.69 45.68,68.69 45.35,69.02 33,69.02 32.75,68.77
STAT: length 10.1
  Top Layer w0.508: LED1.1 20.54,30.2 19.85,30.9 19.85,32.76 20.52,33.43 U4.8
V_SYS: length 32.6
  Top Layer w0.381: U9.7 30.56,11.51 v1(30.58,11.53)
  Bottom Layer w0.381: SW1.2 14.07,8.55 30.24,8.55 31.13,9.45 31.13,10.97 v1(30.58,11.53)
VBS: length 18.4
  Top Layer w0.508: 37.29,37.24 34.59,37.24 ; 37.29,37.24 37.34,37.29 C15.2 ; 37.29,37.24 40.91,37.24 D4.2 ; 34.59,37.24 34.54,37.29 C16.2 ; 34.59,37.24 31.81,37.24 ; C17.2 31.81,38.99 31.81,37.24 ; 31.81,37.24 28.09,37.24
VDCID: length 25.6
  Top Layer w0.178: 29.68,71.49 29.22,71.95 29.22,72.29 28.76,72.75 28.73,72.75 ; 26.96,67.43 26.95,67.43 25.89,66.37 v2(24.75,66.37)
  Top Layer w0.508: v2(29,74.54) 29.07,74.47 29.07,73.1 28.73,72.75 ; L4.2 19.09,64.38 C28.2 24.69,66.31 v2(24.75,66.37)
  Bottom Layer w0.508: v2(29,74.54) 27.05,72.59 27.05,67.72 25.69,66.37 v2(24.75,66.37)
VSW: length 15
  Top Layer w0.178: L4.1 20.38,57.55 21.65,58.83 21.65,62.33 23.9,64.58 24.62,64.58 U6.2
X32MI: length 9.5
  Top Layer w0.178: X1.1 34.55,74.25 34.11,73.82 34.11,72 33.61,71.5 32.04,71.5 31.04,70.5 31.01,70.5
X32MO: length 10.5
  Top Layer w0.178: 31.26,70.25 32.2,71.19 35.1,71.19 35.28,71.37 35.28,72.24 36.2,73.15 38.48,73.15 X1.3
$1N6719: length 5.5
  Top Layer w0.254: R17.2 LED4.1
$1N6815: length 2.7
  Top Layer w0.508: LED1.2 29,30.2 R9.2
$1N6820: length 7.8
  Top Layer w0.178: U4.7 20.12,34.7 18.23,32.81 NTH1.1
  Top Layer w0.254: NTH1.1 R10.1
$1N6822: length 4.5
  Top Layer w0.508: R11.1 22.69,35.97
$1N6830: length 3.5
  Top Layer w0.254: U5.1 C22.1
$1N6831: length 7.6
  Top Layer w0.178: 11.97,19.87 12.01,19.91 12.01,22.14 9.9,24.24 U5.9
$1N6943: length 1.9
  Top Layer w0.508: LED3.2 21.9,47.8 21.88,47.78
$1N6944: length 1.9
  Top Layer w0.508: LED2.2 23.66,45.72 21.88,45.72
$1N6958: length 5.4
  Top Layer w0.381: R19.2 34.67,11.39 35.71,10.35 35.71,7.35
$1N12100: length 5.4
  Top Layer w0.254: 15.06,10.86 R21.1 20.44,10.86
$1N12359: length 6.2
  Top Layer w0.381: U9.4 19.28,10.21 18.7,9.63 18.7,7.47 19.11,7.06 R23.2

## Copper pours and planes (outline as drawn; the poured copper is in the pictures)
GND on Top Layer: -9.86,77.44 62.79,77.44 62.79,-4.73 -9.86,-4.73
GND on Top Layer: 26.42,71.12 32.51,71.12 32.51,65.4 26.42,65.4
GND on Top Layer: 31.42,77.59 50.67,77.59 50.67,76.58 31.42,76.58
GND on Top Layer: 31.83,78.38 32.89,78.38 32.89,77.31 31.83,77.31
GND on Top Layer: 29.68,70.54 27.27,68.12 27.27,67.94 29.68,65.53 29.85,65.53 32.39,68.07 29.92,70.54
GND on Bottom Layer: -15.11,77.59 77.22,77.59 77.22,-16 -15.11,-16

Small or netless copper shapes (teardrops, artwork), in the pictures only: 260 on Top Layer, 67 on Bottom Layer

## Text on the board
Top Silkscreen Layer: BAT- | BAT+ | FS | OFF | PA13 | PA12 | PA10 | PB17 | PB16 | PA4 | PA6 | PA3 | PA8 | PB9 | PB8 | GND | PA1 | ON | PA15 | 3V3 | PA5 | PA0 | PA2 | PA14 | PA11 | PA9 | PA7 | NFC_CTR | LED0 | LED1 | VCC | PB20 | PB22 | PB10 | PB12 | PB14 | PB18 | PB0 | PB2 | PB4 | PB6 | 5V | PB23 | PB19 | PB21 | PB1 | PB3 | PB5 | PB7 | PB11 | PB13 | PB15
